# EAGLE schematic ShutdownOverview (EAGLE 8.3.1)
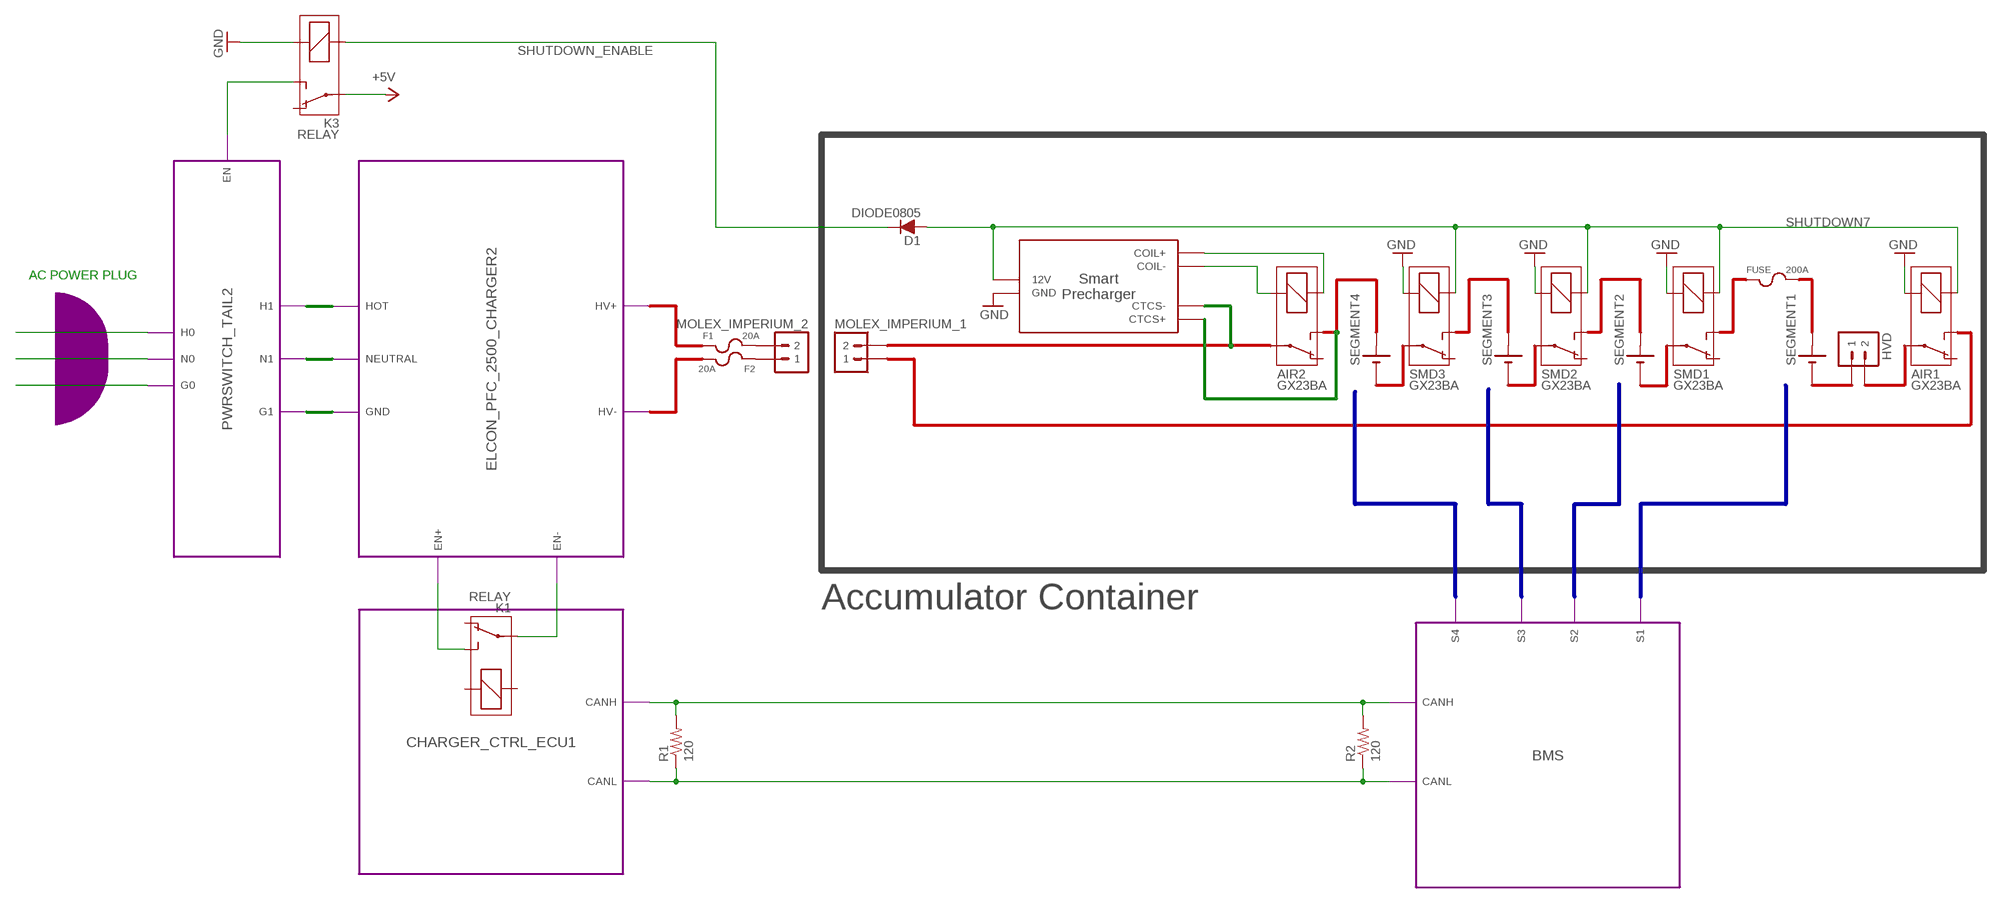
[diagram p0: schematic, sheet 1]

## Parts
AIR1  GX23BA  RELAY  (no package)
AIR2  GX23BA  RELAY  (no package)
D1  DIODE0805  [0805_D]
F1  20A  FUSE  (no package)
F2  20A  FUSE  (no package)
FUSE  200A  FUSE  (no package)
HVD  M02  (no package)
K1  RELAY  (no package)
K3  RELAY  (no package)
MOLEX_IMPERIUM_1  M02  (no package)
MOLEX_IMPERIUM_2  M02  (no package)
R1  120  RESISTORPTH-1/4W  [AXIAL-0.4]
R2  120  RESISTORPTH-1/4W  [AXIAL-0.4]
SEGMENT1  BATTERY_1_CELL  (no package)
SEGMENT2  BATTERY_1_CELL  (no package)
SEGMENT3  BATTERY_1_CELL  (no package)
SEGMENT4  BATTERY_1_CELL  (no package)
SMD1  GX23BA  RELAY  (no package)
SMD2  GX23BA  RELAY  (no package)
SMD3  GX23BA  RELAY  (no package)
U$3  SMART_PRECHARGER  (no package)

## Module instances
ELCON_PFC_2500_CHARGER2 = ELCON_PFC_2500_CHARGER
PWRSWITCH_TAIL2 = PWRSWITCH_TAIL
BMS = BMS
CHARGER_CTRL_ECU1 = CHARGER_CTRL_ECU

## Nets
+5V: K3.P
GND: AIR1.2 K3.1 SMD1.2 SMD2.2 SMD3.2 U$3.GND
N$1: K3.S ; port PWRSWITCH_TAIL2.EN
N$16: port PWRSWITCH_TAIL2.H1 ELCON_PFC_2500_CHARGER2.HOT
N$17: port PWRSWITCH_TAIL2.N1 ELCON_PFC_2500_CHARGER2.NEUTRAL
N$18: port PWRSWITCH_TAIL2.G1 ELCON_PFC_2500_CHARGER2.GND
N$20: port PWRSWITCH_TAIL2.G0
N$22: port PWRSWITCH_TAIL2.N0
N$23: port PWRSWITCH_TAIL2.H0
N$24: K1.S ; port ELCON_PFC_2500_CHARGER2.EN+
N$25: K1.P ; port ELCON_PFC_2500_CHARGER2.EN-
N$31: F2.1 MOLEX_IMPERIUM_2.1
N$32: F1.2 MOLEX_IMPERIUM_2.2
N$37: R1.P$2 R2.P$2 ; port CHARGER_CTRL_ECU1.CANH BMS.CANH
N$38: R1.P$1 R2.P$1 ; port CHARGER_CTRL_ECU1.CANL BMS.CANL
N$42: U$3.CTCS-
N$45: AIR2.2 U$3.COIL-
N$54: AIR2.1 U$3.COIL+
N$60: U$3.CTCS+
SHUTDOWN7: AIR1.1 D1.A SMD1.1 SMD2.1 SMD3.1 U$3.12V
SHUTDOWN_ENABLE: D1.C K3.2
Unconnected: AIR1.O AIR1.P AIR1.S AIR2.O AIR2.P AIR2.S F1.1 F2.2 FUSE.1 FUSE.2 HVD.1 HVD.2 K1.1 K1.2 K1.O K3.O MOLEX_IMPERIUM_1.1 MOLEX_IMPERIUM_1.2 SEGMENT1.+ SEGMENT1.- SEGMENT2.+ SEGMENT2.- SEGMENT3.+ SEGMENT3.- SEGMENT4.+ SEGMENT4.- SMD1.O SMD1.P SMD1.S SMD2.O SMD2.P SMD2.S SMD3.O SMD3.P SMD3.S

## Buses
B$1
B$2
B$3
B$4

## Notes on the sheet
- AC POWER PLUG
- Accumulator Container

## Library data of the parts
AIR1 AIR2 K1 K3 SMD1-SMD3 = HyTechSymbols:RELAY: RELAY 1 x switch
D1 = HyTechDevices:DIODE: DIODE general purpose rectifier
F1 F2 FUSE = HyTechSymbols:FUSE: Generic Fuse
HVD MOLEX_IMPERIUM_1 MOLEX_IMPERIUM_2 = HyTechSymbols:M02: Generic 2-pin connector
R1 R2 = HyTechDevices:RESISTOR: Resistor Basic schematic elements and footprints for 0603, 1206, and PTH resistors.
SEGMENT1-SEGMENT4 = HyTechSymbols:BATTERY_1_CELL: Generic 1-cell battery Source: Sonnenschein
U$3 = HyTechSymbols:SMART_PRECHARGER: Smart Precharger http://www.zeva.com.au/Products/datasheets/SmartPrechargerV1-3.pdf

## Module ACCUMULATOR
Ports: SHUTDOWN_IN(in) SHUTDOWN_INTERLOCK(out) MOLEX_IMPERIUM_HV+(pwr) MOLEX_IMPERIUM_HV-(pwr)

### Library data of the parts

## Module ELCON_PFC_2500_CHARGER
Ports: HV+(out) HV-(out) HOT(pwr) NEUTRAL(pwr) GND(pwr) EN+(out) EN-(in)

### Library data of the parts

## Module PWRSWITCH_TAIL
Ports: H1(out) N1(out) G1(out) EN(in) H0(pwr) N0(pwr) G0(pwr)

### Library data of the parts

## Module HV_BOARD
Ports: GND(in) TSAL/TSEL_POWER(out) BSPD_CUR_FAULT(out) IMD_SUPPLY(out) IMD_GND(in) IMD_HV+(nc) IMD_HV-(nc) HV+UNFUSED(in) HV-UNFUSED(out) 12VSUPPLY(in) CANH_IN(io) CANL_IN(io) CANH_OUT(io) CANL_OUT(io) BMS_OK_OUT(out) HV+FUSED(in) HV-FUSED(out) AIR_PWR1(out) SHUTDOWN6_IN(in) SHUTDOWN6_OUT(out) SHUTDOWN7_IN(in) IMD_OKHS(in) OKHS_OUT(out) SHUTDOWN7_EXT_OUT(out) INDIC+(out) INDIC-(in) DISCHARGE+(out) DISCHARGE-(in) CUR_SENSE_RAW_2(in) TEMP_SENSE_RAW_2(in) CUR_GND_2(in) CUR_5V_2(out) EM_VCC(out) EM_GND(in) EM_IO1(io) EM_IO2(io) EM_IO1_OUT(io) EM_IO2_OUT(io) ISOSPI_P(io) ISOSPI_M(io) CUR_5V_1(out) CUR_SENSE_RAW_1(in) TEMP_SENSE_RAW_1(in) CUR_GND_1(in) DISCHARGE_RELAY_GND(out)

### Library data of the parts

## Module BMS_SEGMENT
Ports: ISOSPI1(io) ISOSPI2(io) ISOSPI3(io) ISOSPI4(io)

### Library data of the parts

## Module ENERGY_METER
Ports: HV+IN(in) HV-OUT(in) HV-IN(out) VCC(in) GND(out) IO1(io) IO2(io)

### Library data of the parts

## Module CUR_SENSE
Ports: CUR_GND(out) CUR_SENSE(out) TEMP_SENSE(out) CUR_5V(in)

### Library data of the parts

## Module BMS_SEGMENT_TEST
Ports: ISOSPI3(io) ISOSPI4(io) ISOSPI1(io) ISOSPI2(io) AMS_TEST_1(out) AMS_TEST_2(in)

### Library data of the parts

## Module BMS
Ports: S4(io) S3(io) S2(io) S1(io) CANH(io) CANL(io)

### Library data of the parts

## Module CHARGER_CTRL_ECU
Ports: CANH(io) CANL(io)

### Library data of the parts